# EAGLE design lights_a (EAGLE 6.5.0)
REV: A; TITLE: Lights
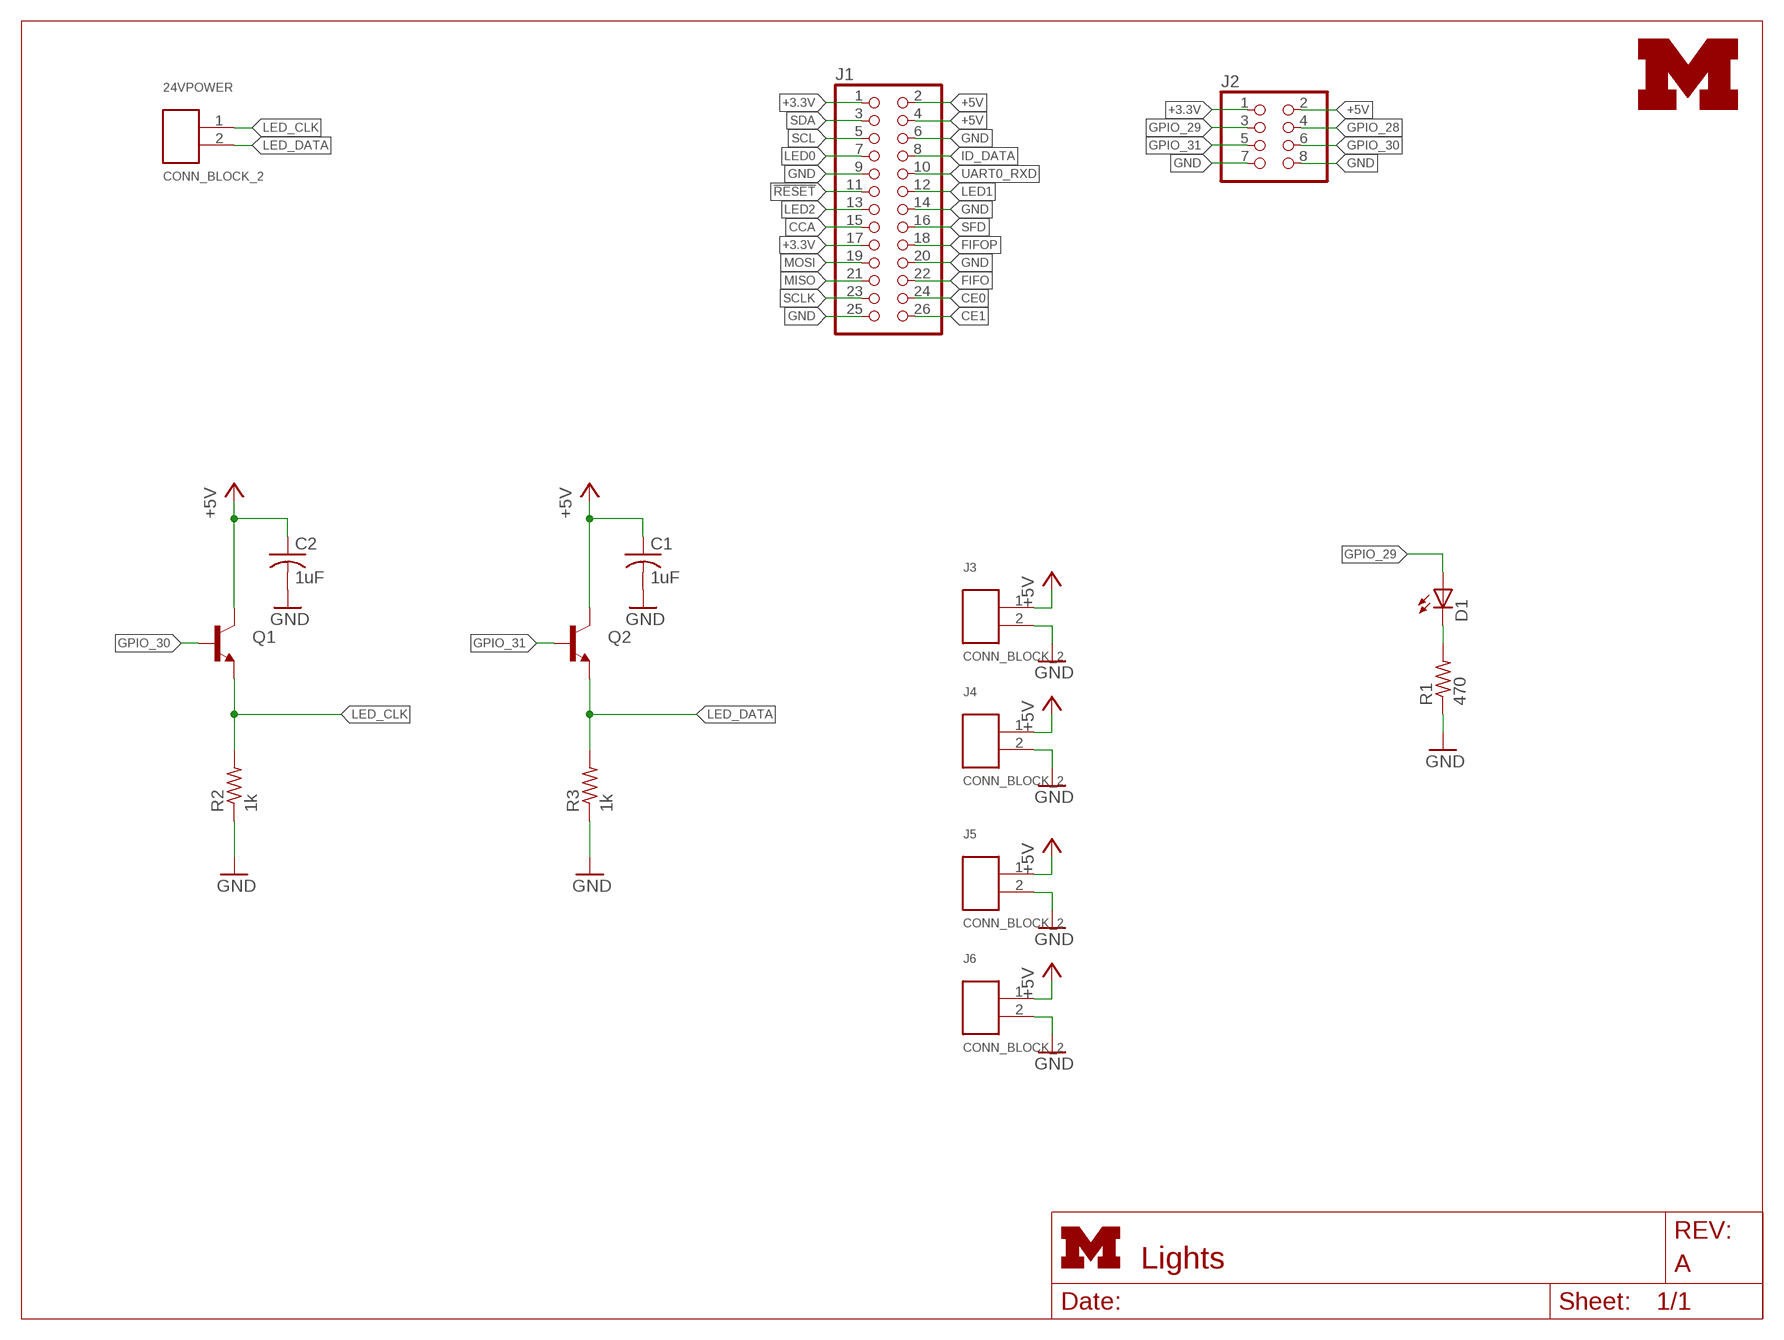
[diagram p0: schematic, sheet 1]
FRAME1 (LETTER_L): HEIGHT: 8.5in; WIDTH: 11in

## Parts
24VPOWER  CONN_BLOCK_2  [CONN_BLOCK_2]
C1  1uF  C-USC0603  [C0603]
C2  1uF  C-USC0603  [C0603]
D1  LED0603  [LED-0603]
J1  PINHD-2X13  [2X13]
J2  PINHD-2X4  [2X04]
J3  CONN_BLOCK_2  [CONN_BLOCK_2]
J4  CONN_BLOCK_2  [CONN_BLOCK_2]
J5  CONN_BLOCK_2  [CONN_BLOCK_2]
J6  CONN_BLOCK_2  [CONN_BLOCK_2]
Q1  TRANSISTOR_NPNSOT23  [SOT23]
Q2  TRANSISTOR_NPNSOT23  [SOT23]
R1  470  R-US_R0603  [R0603]
R2  1k  R-US_R0603  [R0603]
R3  1k  R-US_R0603  [R0603]
U$1  UMICH_SOLID_SMALL  [UMICH_SOLID_75MIL]

## Nets
!RESET: J1.11
+3.3V: J1.1 J1.17 J2.1
+5V: C1.1 C2.1 J1.2 J1.4 J2.2 J3.1 J4.1 J5.1 J6.1 Q1.3(C) Q2.3(C)
CCA: J1.15
CE0: J1.24
CE1: J1.26
FIFO: J1.22
FIFOP: J1.18
GND: C1.2 C2.2 J1.6 J1.9 J1.14 J1.20 J1.25 J2.7 J2.8 J3.2 J4.2 J5.2 J6.2 R1.1 R2.1 R3.1
GPIO_28: J2.4
GPIO_29: D1.A J2.3
GPIO_30: J2.6 Q1.1(B)
GPIO_31: J2.5 Q2.1(B)
ID_DATA: J1.8
LED0: J1.7
LED1: J1.12
LED2: J1.13
LED_CLK: 24VPOWER.1 Q1.2(E) R2.2
LED_DATA: 24VPOWER.2 Q2.2(E) R3.2
MISO: J1.21
MOSI: J1.19
N$1: D1.C R1.2
SCL: J1.5
SCLK: J1.23
SDA: J1.3
SFD: J1.16
UART0_RXD: J1.10

## Library data of the parts
24VPOWER J3-J6 = door-control:CONN_BLOCK_2: 2x 0.100 in screw terminal block; DIGIKEY: 277-1273-ND
C1 C2 = resistor:C-US: CAPACITOR, American symbol
D1 = SparkFun-LED:LED: LEDs Standard schematic elements and footprints for 5mm, 3mm, 1206, and 0603 sized LEDs. 5mm - Spark Fun Electronics SKU : COM-00529 (and others); DIGIKEY: 160-1834-1-ND
J1 = pinhead:PINHD-2X13: PIN HEADER; DIGIKEY: SAM1204-13-ND
J2 = pinhead:PINHD-2X4: PIN HEADER
Q1 Q2 = door-control:TRANSISTOR_NPN: Transistor NPN BJT configuration in SOT23 package. MMBT2222 is the common NPN we use. Double check BCE configuration again layout.
R1-R3 = resistor:R-US_: RESISTOR, American symbol
U$1 = logos:UMICH_SOLID

## Board
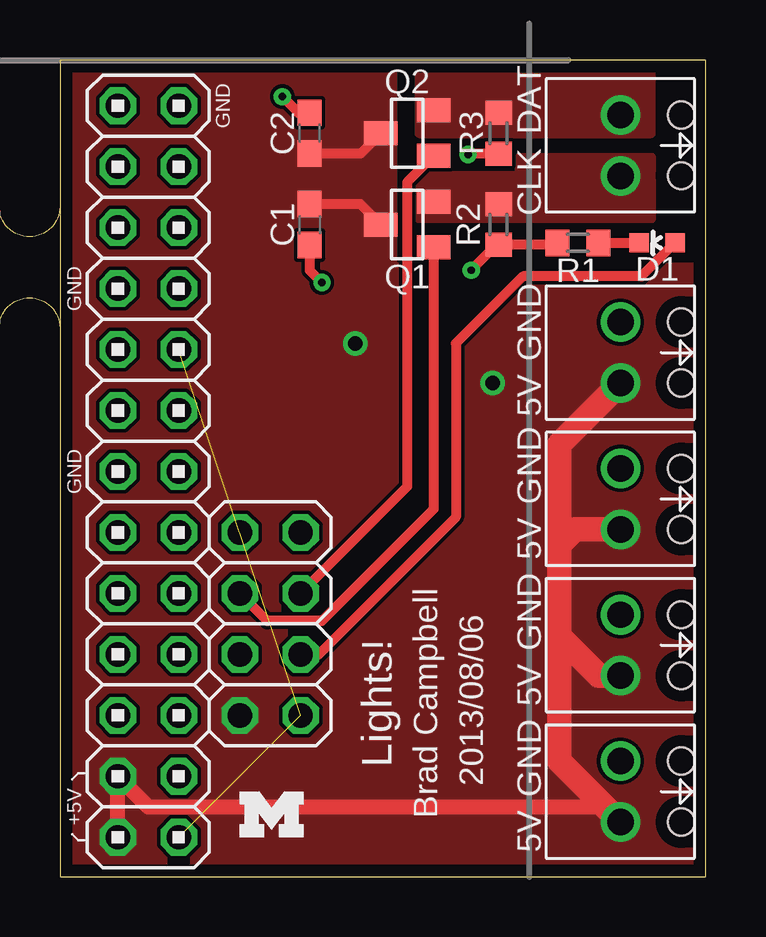
[diagram p1: board, top side]
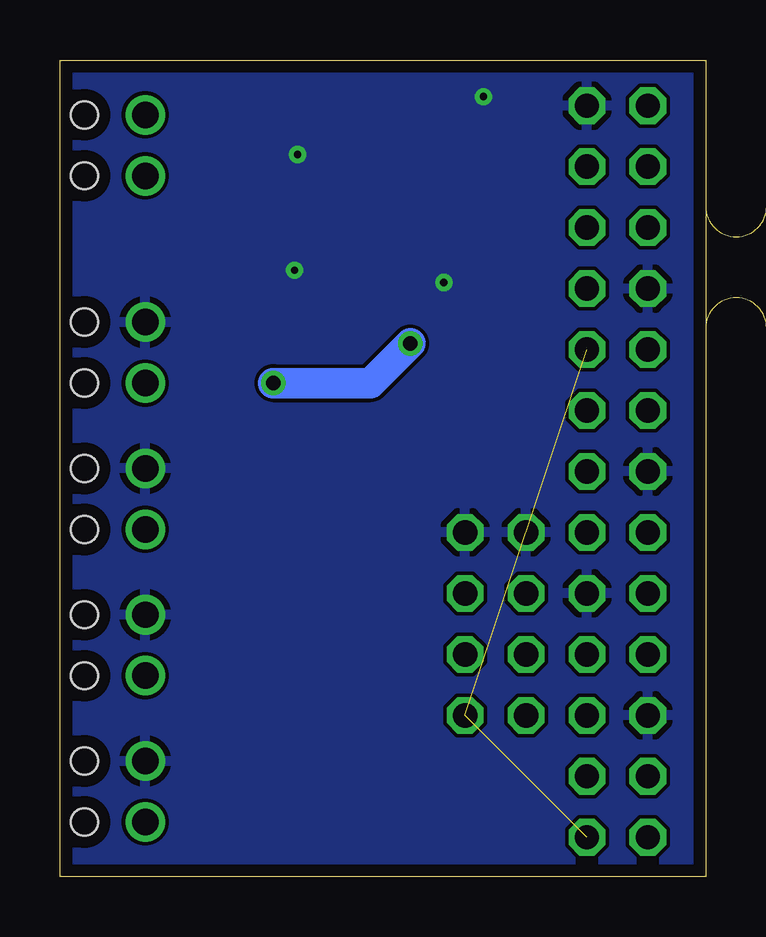
[diagram p2: board, bottom side, seen from below]

Size 26.92 x 34.04 mm. Coordinates in mm from the lower left corner, seen from the top.
Outline: 0,0 26.92,0 26.92,34.04 0,34.04 0,0
Copper layers (1*16): Top 0.0178mm / dielectric 59mil / Bottom 0.0178mm
Design rules "sunstone-2lyr_v1.0.0.3 *": minimum track width 6mil, minimum drill 14mil, track to track 6mil, track to pad 6mil, pad to pad 6mil, via to via 6mil, smd to smd 6mil, copper to edge 20mil, drill to drill 16mil, minimum pad ring 8mil, minimum via ring 8mil, stop-mask expansion 3mil, vias tented up to drill 12mil, thermal gap 10mil
Milling: 7 lines

### Footprints (pad centres in the part's own frame; a part is rotated, then mirrored left to right if it is on the bottom)
CONN_BLOCK_2 = drill 1.1: 1 -1.27,0; 2 1.27,0 | hole 1.12: -1.27,-2.54; 1.27,-2.54
C0603 = smd 1.1 x 1: 1 -0.85,0; 2 0.85,0
LED-0603 = smd 0.8 x 0.8: A 0,-0.75; C 0,0.75
2X13 = drill 1.016 octagon: 1 -15.24,-1.27; 2 -15.24,1.27; 3 -12.7,-1.27; 4 -12.7,1.27; 5 -10.16,-1.27; 6 -10.16,1.27; 7 -7.62,-1.27; 8 -7.62,1.27; 9 -5.08,-1.27; 10 -5.08,1.27; 11 -2.54,-1.27; 12 -2.54,1.27; 13 0,-1.27; 14 0,1.27; 15 2.54,-1.27; 16 2.54,1.27; 17 5.08,-1.27; 18 5.08,1.27; 19 7.62,-1.27; 20 7.62,1.27; 21 10.16,-1.27; 22 10.16,1.27; 23 12.7,-1.27; 24 12.7,1.27; 25 15.24,-1.27; 26 15.24,1.27
2X04 = drill 1.016 octagon: 1 -3.81,-1.27; 2 -3.81,1.27; 3 -1.27,-1.27; 4 -1.27,1.27; 5 1.27,-1.27; 6 1.27,1.27; 7 3.81,-1.27; 8 3.81,1.27
SOT23 = smd 1 x 1.4: 1 -0.95,-1.1; 2 0.95,-1.1; 3 0,1.1
R0603 = smd 1 x 1.1: 1 -0.85,0; 2 0.85,0

### Placement (x,y rotation side)
24VPOWER  23.37,30.48 90 top
C1  10.41,27.18 270 top
C2  10.41,30.99 90 top
D1  24.89,26.42 90 top
J1  3.68,16.89 90 top
J2  8.76,10.54 90 top
J3  23.37,15.75 90 top
J4  23.37,3.56 90 top
J5  23.37,9.65 90 top
J6  23.37,21.84 90 top
Q1  14.48,27.18 90 top
Q2  14.48,30.99 90 top
R1  21.59,26.42 0 top
R2  18.29,27.18 90 top
R3  18.29,30.99 90 top
U$1  7.49,1.65 0 top

### Tracks (layer width: path | path; a pad name or v marks a point on that pad's centre or on a via)
+3.3V  (2 unrouted)
+5V  (via drill 0.61)
  Top 0.406: Q1.3 12.53,28.03 C1.1 | Q2.3 12.53,30.14 C2.1
  Top 0.635: J4.1 22.73,2.92 3.68,2.92 J1.4 J1.2
  Top 1.016: J5.1 22.48,8.38 20.83,10.03 | 20.83,10.03 20.83,13.84 | 20.83,13.84 20.83,18.03 J6.1 | J3.1 21.46,14.48 20.83,13.84 | 20.83,10.03 20.83,4.83 J4.1
  Bottom 1.27: v18.03,20.57 13.97,20.57 v12.32,22.23
  pour Top (no thermals): 0,0 0,35.56 27.94,35.56 27.94,34.04 13.84,34.04 13.84,25.4 27.94,25.4 27.94,0
GND  (via drill 0.3)
  Top 0.406: R1.1 20.65,26.33 R2.1 18.2,26.33 v17.14,25.27 | R3.1 17.06,30.14 v17.02,30.1 | C1.2 10.41,25.27 v10.92,24.77 | C2.2 9.95,31.84 v9.27,32.51
  pour Bottom: 0,0 0,35.56 30.48,35.56 30.48,0
GPIO_29
  Top 0.406: D1.A 24.25,25.02 19.3,25.02 16.51,22.23 16.51,14.99 10.79,9.27 J2.3
GPIO_30
  Top 0.406: J2.6 8.64,10.67 10.92,10.67 15.58,15.32 Q1.1
GPIO_31
  Top 0.406: Q2.1 14.48,28.94 14.48,16.26 J2.5
LED_CLK
  Top 0.406: 15.68,28.03 Q1.2
  pour Top (no thermals): 24.64,27.43 14.99,27.43 14.99,29.21 19.18,29.21 19.18,29.97 24.64,29.97
LED_DATA
  Top 0.406: 15.68,31.84 Q2.2
  pour Top (no thermals): 24.64,33.4 14.99,33.4 14.99,30.99 24.64,30.99
N$1
  Top 0.406: R1.2 D1.C

### Text on the board
tPlace: GND | DAT | CLK | GND | GND | 5V | GND | GND | 5V | GND | 5V | Lights! | Brad Campbell | 2013/08/06 | GND | +5V | 5V
tDocu: CC2520 Edge
_tNames: Q2 | Q2 | C4 | C4 | R3 | R3 | C1 | C1 | R2 | R2 | Q1 | Q1 | R1 | R1 | D1 | D1